# Altium project Controller.PrjPcb
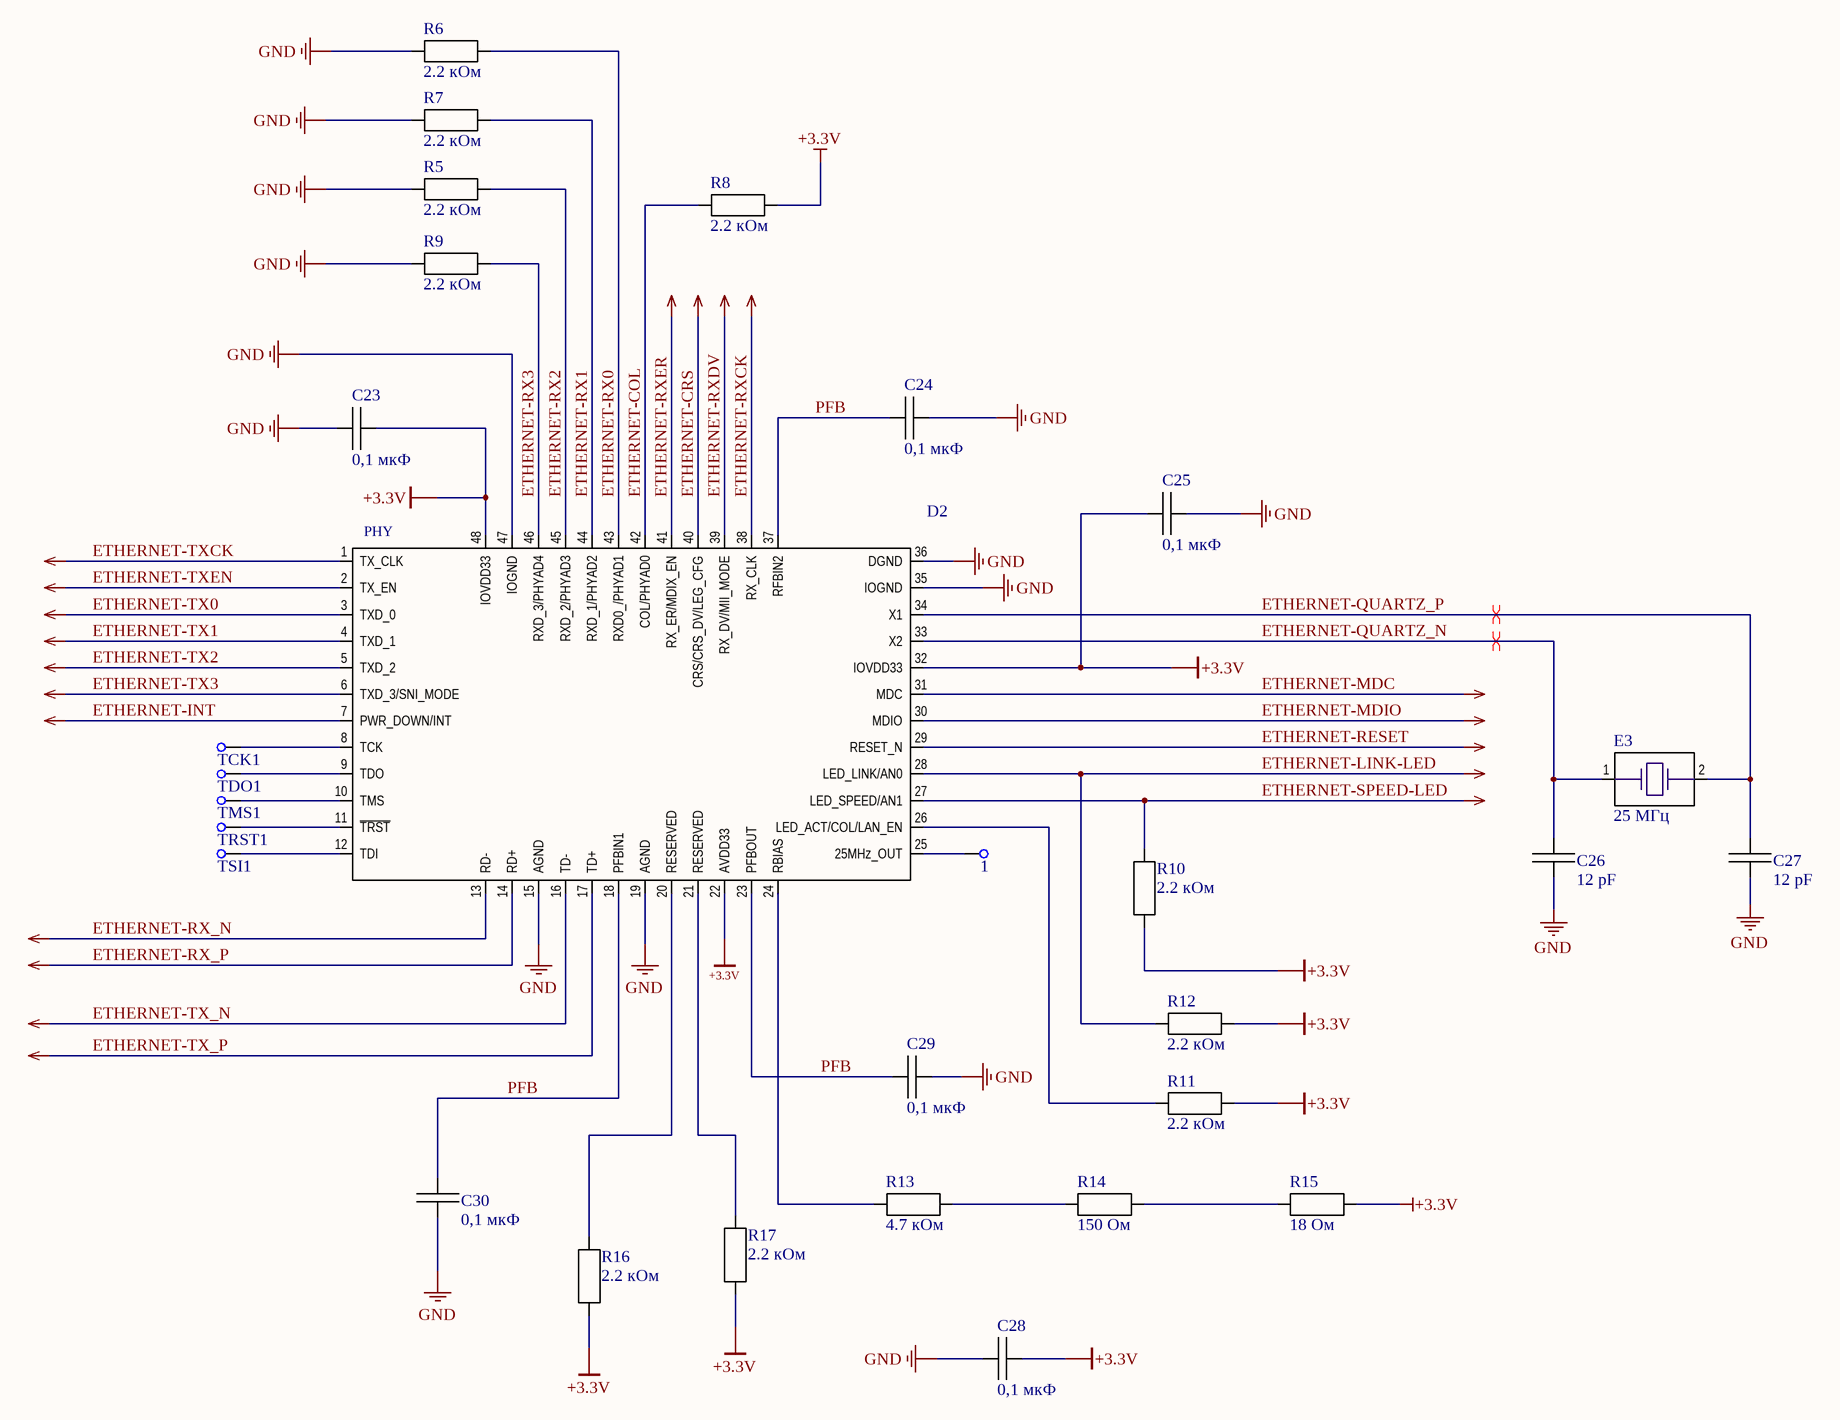
[diagram p0: Ethernet.SchDoc]
2 sheets, 44 parts. Net scope: global (net labels, ports and power ports of the same name join across sheets).
Board file: PCB3.PcbDoc
Sheets:
  Ethernet.SchDoc
  Netconn.SchDoc

## Sheet Ethernet.SchDoc
size 594 x 420 mm; Scale: 1:1; Разраб.: Иванов; Обозначение документа: АБВГ.123456.001 Э3; Пров.: Петров; Утв.: Сидоров; Наименование организации: ОАО "Концерн "МПО-Гидроприбор"; Перв. применение: АБВГ.123456.000; Наименование изделия 1: Плата; Наименование изделия 2: Схема электрическая; Наименование изделия 3: принципиальная; Нач. отд.: Нач. отд.; Фамилия нач. отд.: Сидоров

### Parts
1  (no value)  [PAD0,7X1.5]
C23  0,1 мкФ  [0603-AVX]
C24  0,1 мкФ  [0603-AVX]
C25  0,1 мкФ  [0603-AVX]
C26  12 pF  [0603-AVX]
C27  12 pF  [0603-AVX]
C28  0,1 мкФ  [0603-AVX]
C29  0,1 мкФ  [0603-AVX]
C30  0,1 мкФ  [0603-AVX]
D2  (no value)  [S-PQFP-G48]
E3  25 МГц  [HC49]
R5  2.2 кОм  [Р1-8МП-0,125]
R6  2.2 кОм  [Р1-8МП-0,125]
R7  2.2 кОм  [Р1-8МП-0,125]
R8  2.2 кОм  [Р1-8МП-0,125]
R9  2.2 кОм  [Р1-8МП-0,125]
R10  2.2 кОм  [Р1-8МП-0,125]
R11  2.2 кОм  [Р1-8МП-0,125]
R12  2.2 кОм  [Р1-8МП-0,125]
R13  4.7 кОм  [Р1-8МП-0,125]
R14  150 Ом  [Р1-8МП-0,125]
R15  18 Ом  [Р1-8МП-0,125]
R16  2.2 кОм  [Р1-8МП-0,125]
R17  2.2 кОм  [Р1-8МП-0,125]
TCK1  (no value)  [PAD0,7X1.5]
TDO1  (no value)  [PAD0,7X1.5]
TMS1  (no value)  [PAD0,7X1.5]
TRST1  (no value)  [PAD0,7X1.5]
TSI1  (no value)  [PAD0,7X1.5]

### Nets
+3.3V: C23.2 C25.1 C28.2 D2.22(AVDD33) D2.32(IOVDD33) D2.48(IOVDD33) R8.1 R10.2 R11.1 R12.1 R15.1 R16.2 R17.2
ETHERNET-CRS: D2.1(TX_CLK) D2.2(TX_EN) D2.3(TXD_0) D2.4(TXD_1) D2.5(TXD_2) D2.6(TXD_3/SNI_MODE) D2.7(PWR_DOWN/INT) D2.13(RD-) D2.14(RD+) D2.16(TD-) D2.17(TD+) D2.27(LED_SPEED/AN1) D2.28(LED_LINK/AN0) D2.29(RESET_N) D2.30(MDIO) D2.31(MDC) D2.38(RX_CLK) D2.39(RX_DV/MII_MODE) D2.40(CRS/CRS_DV/LEG_CFG) D2.41(RX_ER/MDIX_EN) R10.1 R12.2  [also labelled ETHERNET-INT, ETHERNET-LINK-LED, ETHERNET-MDC, ETHERNET-MDIO, ETHERNET-RESET, ETHERNET-RX_N, ETHERNET-RX_P, ETHERNET-RXCK, ETHERNET-RXDV, ETHERNET-RXER, ETHERNET-SPEED-LED, ETHERNET-TX0, ETHERNET-TX1, ETHERNET-TX2, ETHERNET-TX3, ETHERNET-TX_N, ETHERNET-TX_P, ETHERNET-TXCK, ETHERNET-TXEN]
GND: C23.1 C24.2 C25.2 C26.1 C27.1 C28.1 C29.1 C30.1 D2.15(AGND) D2.19(AGND) D2.35(IOGND) D2.36(DGND) D2.47(IOGND) R5.1 R6.1 R7.1 R9.1
ETHERNET-COL: D2.42(COL/PHYAD0) R8.2
ETHERNET-QUARTZ_N: C26.2 D2.33(X2) E3.1
ETHERNET-QUARTZ_P: C27.2 D2.34(X1) E3.2
ETHERNET-RX0: D2.43(RXD0_/PHYAD1) R6.2
ETHERNET-RX1: D2.44(RXD_1/PHYAD2) R7.2
ETHERNET-RX2: D2.45(RXD_2/PHYAD3) R5.2
ETHERNET-RX3: D2.46(RXD_3/PHYAD4) R9.2
PFB: C24.1 C29.2 C30.2 D2.18(PFBIN1) D2.23(PFBOUT) D2.37(RFBIN2)
Net1_1: 1.1 D2.25(25MHz_OUT)
NetD2_8: D2.8(TCK) TCK1.1
NetD2_9: D2.9(TDO) TDO1.1
NetD2_10: D2.10(TMS) TMS1.1
NetD2_11: D2.11(~{TRST}) TRST1.1
NetD2_12: D2.12(TDI) TSI1.1
NetD2_20: D2.20(RESERVED) R16.1
NetD2_21: D2.21(RESERVED) R17.1
NetD2_24: D2.24(RBIAS) R13.2
NetD2_26: D2.26(LED_ACT/COL/LAN_EN) R11.2
NetR13_1: R13.1 R14.2
NetR14_1: R14.1 R15.2

### Layout directives
differential pair: ETHERNET-QUARTZ_N, ETHERNET-QUARTZ_P

### Notes on the sheet
- Перв. примен.
- Справ. №
- Подп. и дата
- Инв. № дубл.
- Взам. инв. №
- Разраб.
- Изм.
- Лист
- № докум.
- Подп.
- Дата
- Лит.
- Масса
- Масштаб
- Пров.
- Т.контр.
- Листов
- Инв. № подл.
- Утв.
- Н.контр.
- Копировал
- Формат А2
- (in symbol DP83848) PHY

### Library data of the parts
1 TCK1 TDO1 TMS1 TRST1 TSI1 = КП_0,7Х1,5: Category: НЕТ
C23-C25 C28-C30 = 0603-X7R-0,1мкФ-16В-10%: Manufacturer: AVX; ManufacturerPartNumber: 0603YC104KAT2A; TKE: X7R; Power/Voltage: 16 В; Tolerance: ±10%; Category: Конденсатор; Value: 0,1 мкФ; PartNumber: 0603YC104KAT2A
C26 C27 = 0603-X7R-0,01мкФ-50В-10%: Manufacturer: AVX; ManufacturerPartNumber: 06035C103KAT4A; TKE: X7R; Power/Voltage: 50 В; Tolerance: ±10%; Category: Конденсатор; Value: 12 pF; PartNumber: 06035C103KAT4A
D2 = DP83848: Ethernet physical layer transceiver; Manufacturer: Texas Instruments; Category: Микросхема; ManufacturerPartNumber: DP83848
E3 = Crystal oscillator 25Mhz: Category: Генератор; ManufacturerPartNumber: Crystal oscillator 25Mhz; Value: 25 МГц
R5-R17 = Р1-8МП-0,125-1 кОм±1%: PartNumber: ОЖ0.467.164ТУ; ManufacturerPartNumber: Р1-8МП-0,125-1 кОм±1%-0,5-Л; Tolerance: ±1%-0,5-Л; Power/Voltage: 0,125; Category: Резистор
  R5-R12 R16 R17: Value: 2.2 кОм
  R13: Value: 4.7 кОм
  R14: Value: 150 Ом
  R15: Value: 18 Ом

## Sheet Netconn.SchDoc
size 420 x 297 mm; Scale: 1:1; DocumentType: Схема электрическая принципиальная; FirstReferrence: АБВГ.123456.001
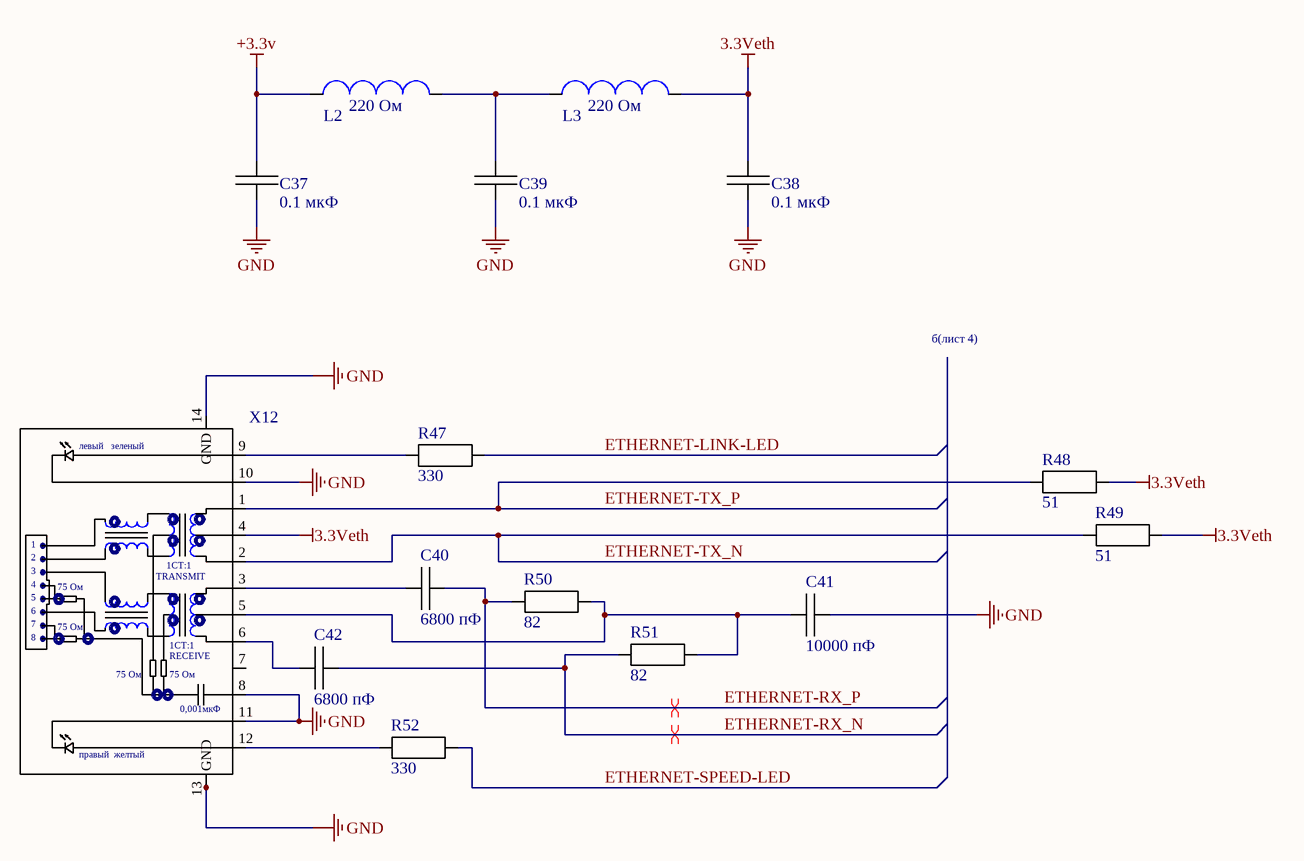
[diagram p1: Netconn.SchDoc]

### Parts
C37  0.1 мкФ  [К10-2,0х1,25х1,0]
C38  0.1 мкФ  [К10-2,0х1,25х1,0]
C39  0.1 мкФ  [К10-2,0х1,25х1,0]
C40  6800 пФ  [К10-2,0х1,25х1,0]
C41  10000 пФ  [К10-2,0х1,25х1,0]
C42  6800 пФ  [К10-2,0х1,25х1,0]
L2  220 Ом  [BLM21P_0805]
L3  220 Ом  [BLM21P_0805]
R47  330  [Р1-12-0,125]
R48  51  [Р1-12-0,125]
R49  51  [Р1-12-0,125]
R50  82  [Р1-12-0,125]
R51  82  [Р1-12-0,125]
R52  330  [Р1-12-0,125]
X12  (no value)  [HR911105]

### Nets
3.3Veth: C38.2 L3.2 R48.2 R49.2 X12.4
+3.3V: C37.2 L2.1
ETHERNET-LINK-LED: C40.2 C42.2 R47.1 R48.1 R49.1 R50.1 R51.1 R52.1 X12.1 X12.2  [also labelled ETHERNET-RX_N, ETHERNET-RX_P, ETHERNET-SPEED-LED, ETHERNET-TX_N, ETHERNET-TX_P]  [project net ETHERNET-CRS]
GND: C37.1 C38.1 C39.1 C41.2 X12.8 X12.10 X12.11 X12.13(GND) X12.14(GND)
NetC39_2: C39.2 L2.2 L3.1
NetC40_1: C40.1 X12.3
NetC41_1: C41.1 R50.2 R51.2 X12.5
NetC42_1: C42.1 X12.6
NetR47_2: R47.2 X12.9
NetR52_2: R52.2 X12.12

Not connected (* = marked no-connect by the designer): X12 7

### Layout directives
differential pair: ETHERNET-CRS

### Notes on the sheet
- б(лист 4)
- Перв. примен.
- Справ. №
- Подп. и дата
- Инв. № дубл.
- Взам. инв. №
- Разраб.
- Изм.
- Лист
- № докум.
- Подп.
- Дата
- Лит.
- Масса
- Масштаб
- Пров.
- Т.контр.
- Листов
- Инв. № подл.
- Утв.
- Н.контр.
- 2.106-A3
- Копировал
- Формат А3
- (in symbol HR911105A) левый   зеленый; 1СТ:1; TRANSMIT; 75 Ом; RECEIVE; 0,001мкФ; правый  желтый

### Library data of the parts
C37-C39 = 0805-X5R-2,2мкФ-10В-10%: Manufacturer: AVX; ManufacturerPartNumber: 0805ZD225KAT2A; TKE: X5R; Power/Voltage: 10 В; Tolerance: ±10%; Value: 2.2 мкФ; Category: Конденсатор; PartNumber: 0805ZD225KAT2A
C40-C42 = 0805-X5R-2,2мкФ-10В-10%: Manufacturer: AVX; ManufacturerPartNumber: 0805ZD225KAT2A; TKE: X5R; Power/Voltage: 10 В; Tolerance: ±10%; Category: Конденсатор; PartNumber: 0805ZD225KAT2A
  C40 C42: Value: 6800 пФ
  C41: Value: 10000 пФ
L2 L3 = BLM21PG221SH1: Manufacturer: Murata; PartNumber1: (220 Ом ±25% 2000мА); Power/Voltage: 2000мА; Tolerance: ±25%; Category: Катушка индуктивности; ManufacturerPartNumber: BLM21PG221SH1; Value: 220 Ом
R47-R52 = Р1-12-0,125-10,0 кОм±1%: PartNumber: АЛЯР.434110.005 ТУ; ManufacturerPartNumber: Р1-12-0,125-10,0 кОм±1%-Л; Tolerance: ±1%-Л; Power/Voltage: 0,125; Value: 10,0 кОм; Category: Резистор
X12 = HR911105A: Manufacturer: Pulse Electronics; PartNumber1: (100 Base-TX, RJ45 1x1, with LEDs, intergrated magnetics); Category: Соединители; ManufacturerPartNumber: HR911105A

## Nets that join several sheets
+3.3V: Ethernet (13 pins), Netconn (C37.2 L2.1)
ETHERNET-CRS: Ethernet (22 pins), Netconn (10 pins)
GND: Ethernet (17 pins), Netconn (9 pins)